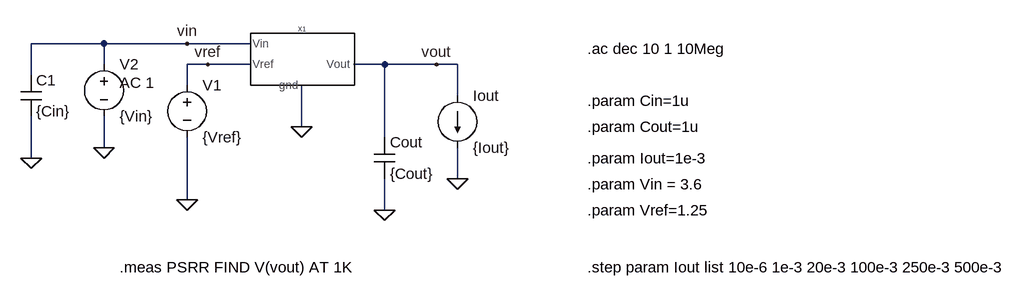
[diagram p0: schematic PSRR_6p33.asc]
PSRR_6p33.asc, the LTspice schematic file:
Version 4
SHEET 1 932 680
WIRE -528 -176 -640 -176
WIRE -400 -176 -528 -176
WIRE -304 -176 -400 -176
WIRE -528 -144 -528 -176
WIRE -368 -144 -400 -144
WIRE -304 -144 -368 -144
WIRE -96 -144 -144 -144
WIRE -16 -144 -96 -144
WIRE 16 -144 -16 -144
WIRE -640 -128 -640 -176
WIRE -400 -112 -400 -144
WIRE 16 -96 16 -144
WIRE -224 -48 -224 -112
WIRE -96 -32 -96 -144
WIRE -528 -16 -528 -64
WIRE -640 0 -640 -64
WIRE 16 32 16 -16
WIRE -400 64 -400 -32
WIRE -96 80 -96 32
FLAG -368 -144 vref
FLAG -400 -176 vin
FLAG -96 80 0
FLAG 16 32 0
FLAG -16 -144 vout
FLAG -224 -48 0
FLAG -528 -16 0
FLAG -400 64 0
FLAG -640 0 0
SYMBOL LDO_basic -224 -160 R0
SYMATTR InstName X1
SYMBOL voltage -400 -128 R0
WINDOW 123 0 0 Left 0
WINDOW 39 0 0 Left 0
SYMATTR InstName V1
SYMATTR Value {Vref}
SYMBOL voltage -528 -160 R0
WINDOW 123 24 44 Left 2
WINDOW 39 0 0 Left 0
SYMATTR Value2 AC 1
SYMATTR InstName V2
SYMATTR Value {Vin}
SYMBOL cap -112 -32 R0
SYMATTR InstName Cout
SYMATTR Value {Cout}
SYMBOL current 16 -96 R0
WINDOW 123 0 0 Left 0
WINDOW 39 0 0 Left 0
SYMATTR InstName Iout
SYMATTR Value {Iout}
SYMBOL cap -656 -128 R0
SYMATTR InstName C1
SYMATTR Value {Cin}
TEXT 216 -168 Left 2 !.ac dec 10 1 10Meg
TEXT 216 0 Left 2 !.param Iout=1e-3
TEXT 216 -48 Left 2 !.param Cout=1u
TEXT 216 -88 Left 2 !.param Cin=1u
TEXT 216 40 Left 2 !.param Vin = 3.6
TEXT 216 80 Left 2 !.param Vref=1.25
TEXT 216 168 Left 2 !.step param Iout list 10e-6 1e-3 20e-3 100e-3 250e-3 500e-3
TEXT -504 168 Left 2 !.meas PSRR FIND V(vout) AT 1K

The netlist it stands for:
* PSRR_6p33.asc
XX1 vin vref 0 vout LDO_basic  ; pins Vin Vref gnd Vout
V1 vref 0 {Vref}
V2 vin 0 {Vin} AC 1
Cout vout 0 {Cout}
Iout vout 0 {Iout}
C1 vin 0 {Cin}
.ac dec 10 1 10Meg
.param Iout=1e-3
.param Cout=1u
.param Cin=1u
.param Vin = 3.6
.param Vref=1.25
.step param Iout list 10e-6 1e-3 20e-3 100e-3 250e-3 500e-3
.meas PSRR FIND V(vout) AT 1K
.backanno
.end